# Altium schematic sheet Sensors.SchDoc: Sensores
size A4; DrawnBy: Cláudio Silva; Engineer: Cláudio Silva; Revision: 1.0; SheetNumber: 3; SheetTotal: 3
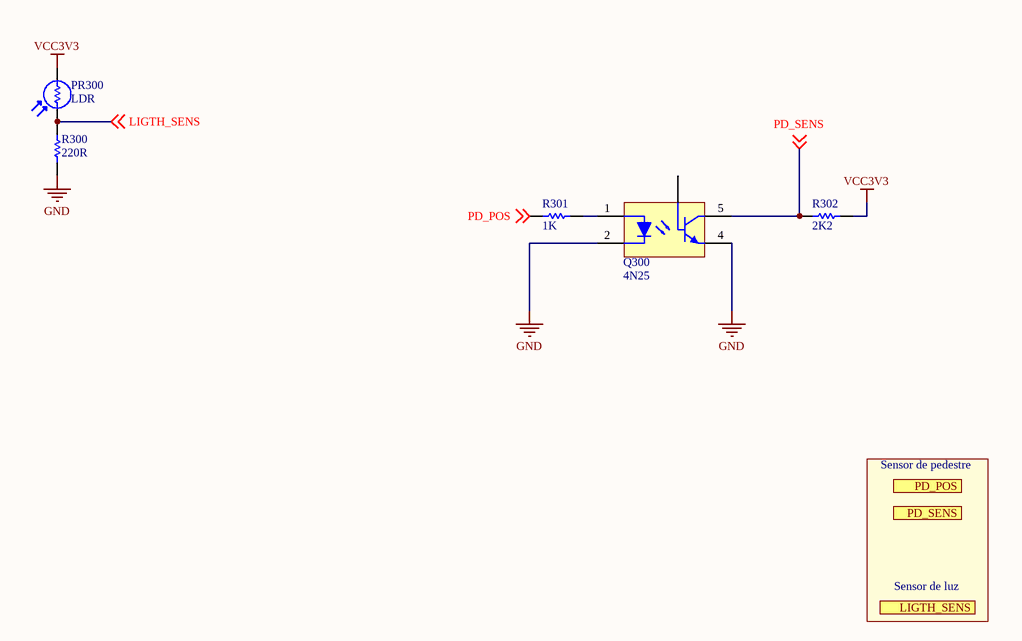
[diagram p0: Sensors.SchDoc]

## Parts
PR300  LDR  [LDR 3x0.5]
Q300  4N25  [6-SMD]
R300  220R  [CR2012-0805]
R301  1K  [CR2012-0805]
R302  2K2  [CR2012-0805]

## Ports
LIGTH_SENS (out), PD_POS, PD_SENS (out)

## Nets
GND: Q300.2(K) Q300.4(E) R300.1
VCC3V3: PR300.2 R302.2
LIGTH_SENS: PR300.1 R300.2 ; off-sheet LIGTH_SENS
PD_POS: R301.1 ; off-sheet PD_POS
PD_SENS: Q300.5(C) R302.1 ; off-sheet PD_SENS
NetQ300_1: Q300.1(A) R301.2

Not connected (* = marked no-connect by the designer): Q300 6(B)

## Notes on the sheet
- Sensor de pedestre
- Sensor de luz

## Library data of the parts
PR300 = LDR GL5506(4-7K) SMD: THROUGH HOLE PHOTORESISTORS ROHS; Manufacturer: JCHL(Shenzhen Jing Chuang He Li Tech); Manufacturer Part Number: GL5506(4-7K); Supplier 1: LCSC; Supplier Part Number 1: C404970
Q300 = OPTOISO 4N25S 2.5KV TRANS W/BASE 6SMD: OPTOISO 4.17KV TRANS W/BASE 6SMD; Manufacturer: ON Semiconductor; Manufacturer Part Number: 4N25SR2M; Max Power Dissipation: 250mW; Supplier 1: Digi-Key; RoHS: No; Category: Optocouplers; Stock 1: 12901; Pricing 1: 1=0,73000, 10=0,57000, 100=0,36570, 500=0,31448 (USD); ComponentLink1URL: http://www.farnell.com/datasheets/2287881.pdf?src-supplier=Farnell; ComponentLink1Description: http://www.farnell.com/datasheets/2287881.pdf?src-supplier=Farnell; ComponentLink2URL: https://produktinfo.conrad.com/datenblaetter/1200000-1299999/001265459-da-01-en-OPTOISOLATOR_TRANS_7__4N25SR2M_SMD_6_ONS.PDF?src-supplier=Conrad; ComponentLink2Description: https://produktinfo.conrad.com/datenblaetter/1200000-1299999/001265459-da-01-en-OPTOISOLATOR_TRANS_7__4N25SR2M_SMD_6_ONS.PDF?src-supplier=Conrad; ComponentLink3URL: http://www.onsemi.com/pub/Collateral/4N37M-D.pdf?src-supplier=Digi-Key; ComponentLink3Description: http://www.onsemi.com/pub/Collateral/4N37M-D.pdf?src-supplier=Digi-Key; ComponentLink4URL: http://www.farnell.com/datasheets/2287881.pdf?src-supplier=Newark; ComponentLink4Description: http://www.farnell.com/datasheets/2287881.pdf?src-supplier=Newark; ComponentLink5URL: https://www.fairchildsemi.com/datasheets/4N/4N25M.pdf?src-supplier=Digi-Key; ComponentLink5Description: https://www.fairchildsemi.com/datasheets/4N/4N25M.pdf?src-supplier=Digi-Key; Supplier Part Number 1: 4N25SR2MCT-ND; Lead Free: Lead Free; Power Dissipation: 250mW; Case/Package: SMD/SMT; Package Quantity: 1000; Supplier 2: LCSC; Supplier Part Number 2: C143074
R300 = RES 220R OHM 5% 1/8W 0805 SMD: RES SMD 220 OHM 5% 1/8W 0805; Manufacturer: Panasonic Electronic Components; Manufacturer Part Number: ERJ-6GEYJ221V; Resistance (Ohms): 220; Power (Watts): 0.125W, 1/8W; Temperature Coefficient: ±200ppm/°C; Supplier 1: Digi-Key; RoHS: RoHS Compliant; Category: Resistors; Stock 1: 118007; Pricing 1: 1=0.1, 10=0.025, 25=0.018, 50=0.0136, 100=0.01, 250=0.00764, 500=0.00612, 1000=0.00451 (USD); Packaging: Cut Tape (CT); Part Status: Active; Tolerance: ±5%; Composition: Thick Film; Features: Automotive AEC-Q200; Operating Temperature: -55°C ~ 155°C; Package / Case: 0805 (2012 Metric); Supplier Device Package: 0805; Size / Dimension: 0.079" L x 0.049" W (2.00mm x 1.25mm); Height - Seated (Max): 0.028" (0.70mm); Failure Rate: -; ComponentLink1URL: http://industrial.panasonic.com/www-cgi/jvcr13pz.cgi?E+PZ+3+AOA0001+ERJ6GEYJ221V+7+WW; ComponentLink1Description: http://industrial.panasonic.com/www-cgi/jvcr13pz.cgi?E+PZ+3+AOA0001+ERJ6GEYJ221V+7+WW; Supplier Part Number 1: P220ACT-ND
R301 = RES 1K OHM 1% 1/8W 0805 SMD: RES SMD 1K OHM 1% 1/8W 0805; Manufacturer: Yageo; Manufacturer Part Number: RC0805FR-071KL; Resistance: 1kR; Voltage Rating (DC): 150V; Temperature Coefficient: 100ppm/°C; Power Rating: 125mW; ComponentLink1URL: http://media.digikey.com/pdf/Data%20Sheets/Rohm%20PDFs/MCR10%20(new)%20series.pdf; ComponentLink1Description: http://media.digikey.com/pdf/Data%20Sheets/Rohm%20PDFs/MCR10%20(new)%20series.pdf; RoHS: Yes; Category: Chip SMD Resistors; Stock 1: 24108233; Pricing 1: 1=0,10000, 10=0,04000, 100=0,01630, 1000=0,00731, 2500=0,00635 (USD); Case/Package: 0805; Number of Pins: 2; Case Code (Metric): 2012; Case Code (Imperial): 0805; Min Operating Temperature: -55°C; Max Operating Temperature: 155°C; Tolerance: 1%; Packaging: Tape and Reel; Composition: Thick Film; Package Quantity: 1; Voltage Rating: 150V; Number of Terminations: 2; Termination: SMD/SMT; Military Standard: Not; Max Power Dissipation: 125mW; Features: Moisture Resistant; Length: 0.079inch; Height: 0.024inch; Width: 0.049inch; Depth: 1.25mm; REACH SVHC: Unknown; Lead Free: Lead Free; ComponentLink2URL: https://datasheet.ciiva.com/2456/pyu-r-int-thick-7-2456976.pdf?src-supplier=Digi-Key; ComponentLink2Description: https://datasheet.ciiva.com/2456/pyu-r-int-thick-7-2456976.pdf?src-supplier=Digi-Key; ComponentLink3URL: https://datasheet.ciiva.com/2456/pyu-r-int-thick-7-2456977.pdf?src-supplier=Digi-Key; ComponentLink3Description: https://datasheet.ciiva.com/2456/pyu-r-int-thick-7-2456977.pdf?src-supplier=Digi-Key; ComponentLink4URL: https://datasheet.ciiva.com/7941/1686128-7941719.pdf?src-supplier=Element14; ComponentLink4Description: https://datasheet.ciiva.com/7941/1686128-7941719.pdf?src-supplier=Element14; ComponentLink5URL: https://datasheet.ciiva.com/16850/rc0805-16850409.pdf?src-supplier=Future+Electronics; ComponentLink5Description: https://datasheet.ciiva.com/16850/rc0805-16850409.pdf?src-supplier=Future+Electronics; ComponentLink6URL: https://datasheet.ciiva.com/46385/444164-46385020.pdf?src-supplier=Element14; ComponentLink6Description: https://datasheet.ciiva.com/46385/444164-46385020.pdf?src-supplier=Element14; ComponentLink7URL: https://datasheet.ciiva.com/2456/pyu-r-int-thick-7-2456975.pdf?src-supplier=Digi-Key; ComponentLink7Description: https://datasheet.ciiva.com/2456/pyu-r-int-thick-7-2456975.pdf?src-supplier=Digi-Key; Supplier 1: Digi-Key; Supplier 2: LCSC; Supplier Part Number 1: 311-1.00KCRDKR-ND; Supplier Part Number 2: C17513
R302 = RES 2K2 OHM 1/8W 5% 0805 SMD: RES SMD 2.2K OHM 5% 1/8W 0805; Manufacturer: Panasonic Electronic Components; Part#: ERJ-6GEYJ222V; eVendor: Digi-Key; eVendorPrice: 0,10; eVendor#: P2.2KACT-ND; MSRP: 0,00459; Power (Watts): 0.125W, 1/8W; Temperature Coefficient: ±200ppm/°C; Datasheet: http://industrial.panasonic.com/www-cgi/jvcr13pz.cgi?E+PZ+3+AOA0001+ERJ6GEYJ222V+7+WW; MOQ: 2500; Obs: ERJ-6GEYJ222V; Supplier 1: Digi-Key; Manufacturer Part Number: ERJ-6GEYJ222V; RoHS: RoHS Compliant; Category: Resistors; Stock 1: 100522; Pricing 1: 1=0.1, 10=0.025, 25=0.018, 50=0.0136, 100=0.01, 250=0.00764, 500=0.00612, 1000=0.00451 (USD); Packaging: Cut Tape (CT); Part Status: Active; Resistance (Ohms): 2.2k; Tolerance: ±5%; Composition: Thick Film; Features: Automotive AEC-Q200; Operating Temperature: -55°C ~ 155°C; Package / Case: 0805 (2012 Metric); Supplier Device Package: 0805; Size / Dimension: 0.079" L x 0.049" W (2.00mm x 1.25mm); Height - Seated (Max): 0.028" (0.70mm); Number of Terminations: 2; Failure Rate: -; ComponentLink1URL: http://industrial.panasonic.com/www-cgi/jvcr13pz.cgi?E+PZ+3+AOA0001+ERJ6GEYJ222V+7+WW; ComponentLink1Description: http://industrial.panasonic.com/www-cgi/jvcr13pz.cgi?E+PZ+3+AOA0001+ERJ6GEYJ222V+7+WW; Supplier Part Number 1: P2.2KACT-ND; Supplier 2: LCSC; Supplier Part Number 2: C17520